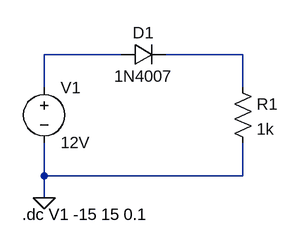
[diagram p0: schematic Diode Selection for a Real Application.asc]
Diode Selection for a Real Application.asc, the LTspice schematic file:
Version 4.1
SHEET 1 880 680
WIRE 144 64 32 64
WIRE 320 64 208 64
WIRE 32 112 32 64
WIRE 320 112 320 64
WIRE 32 240 32 192
WIRE 320 240 320 192
WIRE 320 240 32 240
WIRE 32 272 32 240
FLAG 32 272 0
SYMBOL voltage 32 96 R0
SYMATTR InstName V1
SYMATTR Value 12V
SYMBOL res 304 96 R0
SYMATTR InstName R1
SYMATTR Value 1k
SYMBOL diode 144 80 R270
WINDOW 0 32 32 VTop 2
WINDOW 3 0 32 VBottom 2
SYMATTR InstName D1
SYMATTR Value 1N4007
TEXT 0 296 Left 2 !.dc V1 -15 15 0.1

The netlist it stands for:
* Diode Selection for a Real Application.asc
V1 N001 0 12V
R1 N002 0 1k
D1 N001 N002 1N4007
.model D D
.lib standard.dio
.dc V1 -15 15 0.1
.backanno
.end